# Altium project SignalAnalyse.PrjPCB
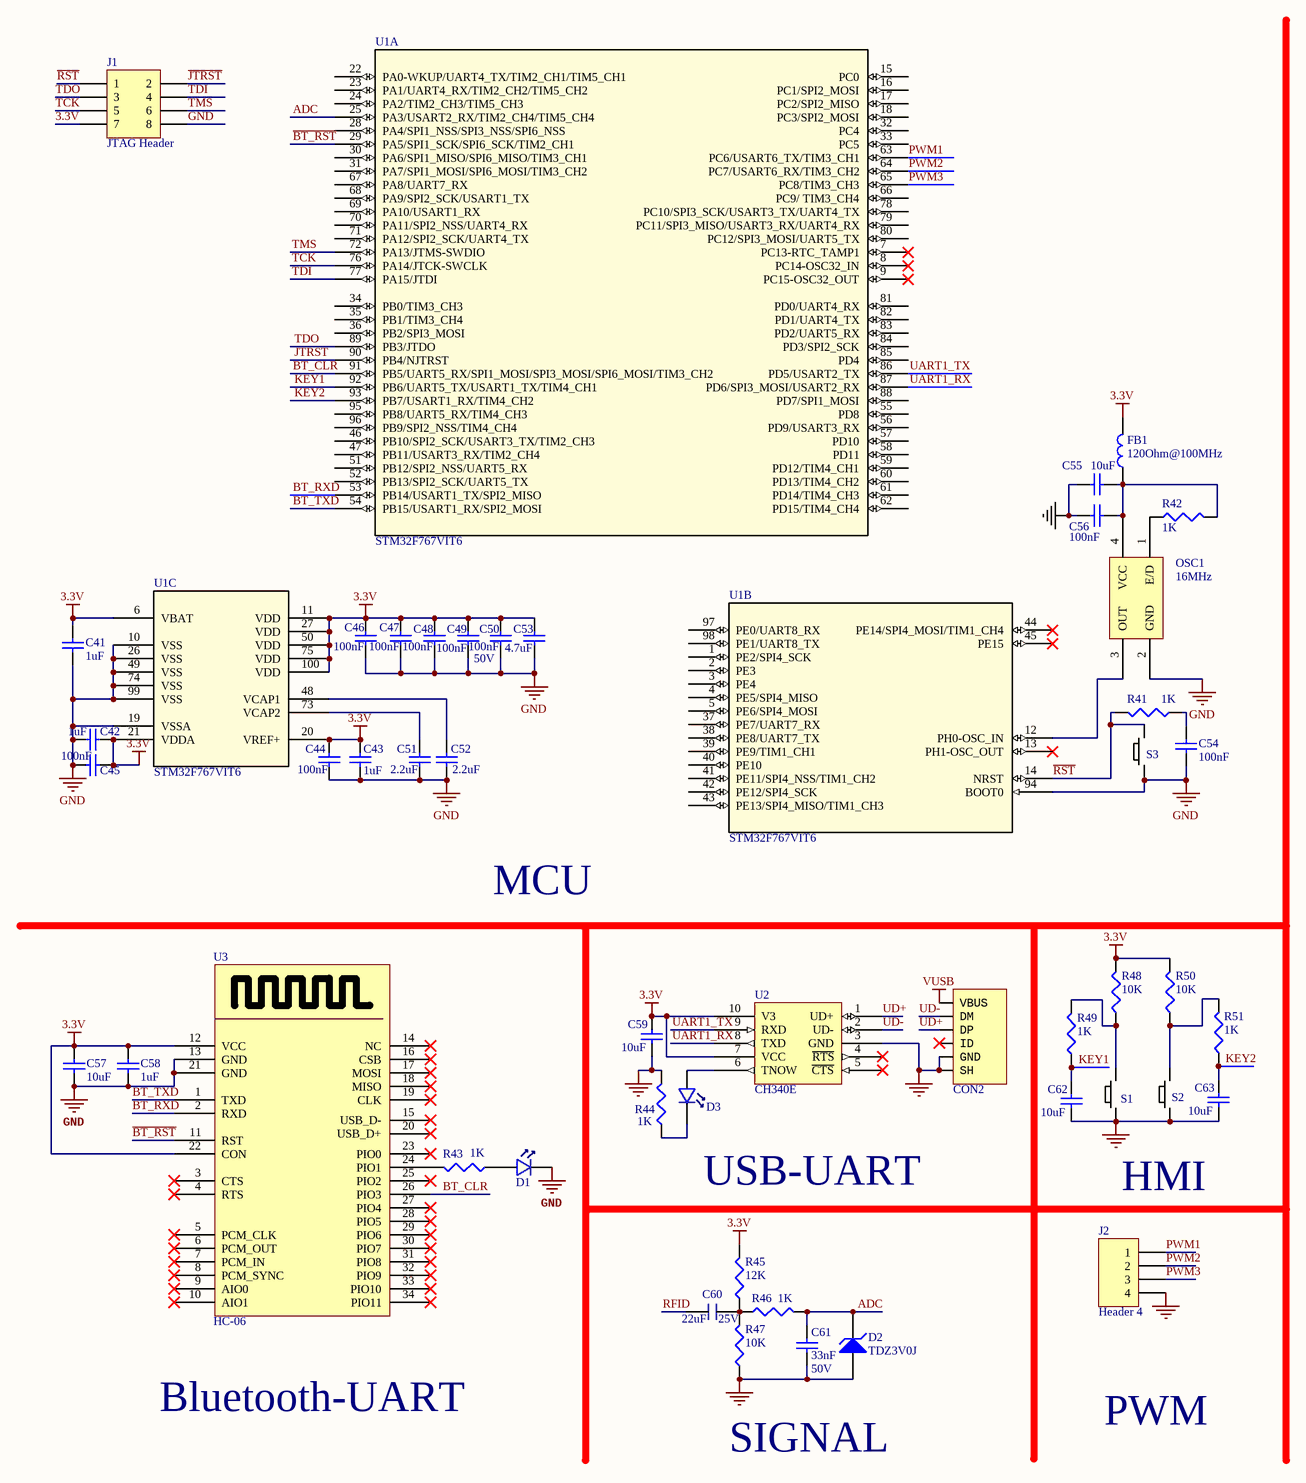
[diagram p0: SignalAnalyse.SchDoc]
2 sheets, 89 parts. Net scope: global (net labels, ports and power ports of the same name join across sheets).
Board file: SignalAnalyse.PcbDoc
Sheets:
  SignalAnalyse.SchDoc
  RFID_transmitter_V2.SchDoc

## Sheet SignalAnalyse.SchDoc
size A3

### Parts
C41  value 1uF  [1608[0603]]  (hidden comment: GRM188R61A226ME15D)
C42  value 1uF  [1608[0603]]  (hidden comment: GRM188R61A226ME15D)
C43  value 1uF  [1608[0603]]  (hidden comment: GRM188R61A226ME15D)
C44  value 100nF  [1608[0603]]  (hidden comment: GRM188R61A226ME15D)
C45  value 100nF  [1608[0603]]  (hidden comment: GRM188R61A226ME15D)
C46  value 100nF  [1608[0603]]  (hidden comment: GRM188R61A226ME15D)
C47  value 100nF  [1608[0603]]  (hidden comment: GRM188R61A226ME15D)
C48  value 100nF  [1608[0603]]  (hidden comment: GRM188R61A226ME15D)
C49  value 100nF  [1608[0603]]  (hidden comment: GRM188R61A226ME15D)
C50  value 100nF  Voltage: 50V  [1608[0603]]  (hidden comment: GRM188R61A226ME15D)
C51  value 2.2uF  [1608[0603]]  (hidden comment: GRM188R61A226ME15D)
C52  value 2.2uF  [1608[0603]]  (hidden comment: GRM188R61A226ME15D)
C53  value 4.7uF  [1608[0603]]  (hidden comment: GRM188R61A226ME15D)
C54  value 100nF  [1608[0603]]  (hidden comment: GRM188R61A226ME15D)
C55  value 10uF  [1608[0603]]  (hidden comment: GRM188R61A226ME15D)
C56  value 100nF  [1608[0603]]  (hidden comment: GRM188R61A226ME15D)
C57  value 10uF  [1608[0603]]  (hidden comment: GRM188R61A226ME15D)
C58  value 1uF  [1608[0603]]  (hidden comment: GRM188R61A226ME15D)
C59  value 10uF  [1608[0603]]  (hidden comment: GRM188R61A226ME15D)
C60  value 22uF  Voltage: 25V  [C0805]  (hidden comment: Cap Ceramic)
C61  value 33nF  Voltage: 50V  [1608[0603]]  (hidden comment: Cap Semi)
C62  value 10uF  [1608[0603]]  (hidden comment: GRM188R61A226ME15D)
C63  value 10uF  [1608[0603]]  (hidden comment: GRM188R61A226ME15D)
CON2  MicroUSB  [USB_Micro-AB]  (value not drawn)
D1  LED  [D0805]  (value not drawn)
D2  TDZ3V0J  [SOD-323]
D3  LED-Green  [D0805]  (value not drawn)
FB1  120Ohm@100MHz  [L0805]
J1  JTAG Header  [HDR2X4]
J2  Header 4  [HDR1X4]
OSC1  16MHz  [OSC_3.2X2.5]
R41  value 1K  [J1-0603]  (hidden comment: Res)
R42  value 1K  [J1-0603]  (hidden comment: Res)
R43  value 1K  [J1-0603]  (hidden comment: Res)
R44  value 1K  [J1-0603]  (hidden comment: Res)
R45  value 12K  [J1-0603]  (hidden comment: Res)
R46  value 1K  [J1-0603]  (hidden comment: Res)
R47  value 10K  [J1-0603]  (hidden comment: Res)
R48  value 10K  [J1-0603]  (hidden comment: Res)
R49  value 1K  [J1-0603]  (hidden comment: Res)
R50  value 10K  [J1-0603]  (hidden comment: Res)
R51  value 1K  [J1-0603]  (hidden comment: Res)
S1  Button  [K2-1107ST-A4SW-06]  (value not drawn)
S2  Button  [K2-1107ST-A4SW-06]  (value not drawn)
S3  Button  [K2-1107ST-A4SW-06]  (value not drawn)
U1  STM32F767VIT6  [STM32F767VIT6]  (parts A,B,C of 3)
U2  CH340E  [CH340E]
U3  HC-06  [HC-06]

### Nets
3.3V: C41.1 C42.1 C43.2 C44.2 C45.1 C46.2 C47.2 C48.2 C49.2 C50.2 C53.2 C57.1 C58.1 C59.1 FB1.1 J1.7 R45.2 R48.2 R50.2 U1.6(VBAT) U1.11(VDD) U1.20(VREF+) U1.21(VDDA) U1.27(VDD) U1.50(VDD) U1.75(VDD) U1.100(VDD) U2.7(VCC) U2.10(V3) U3.12(VCC) U3.22(CON)
GND: C41.2 C42.2 C43.1 C44.1 C45.2 C46.1 C47.1 C48.1 C49.1 C50.1 C51.1 C52.1 C53.1 C54.2 C55.2 C56.2 C57.2 C58.2 C59.2 C61.1 C62.2 C63.2 CON2.0(SH) CON2.5(GND) D1.2 D2.1(A) J1.8 J2.4 OSC1.2(GND) R44.2 R47.1 S1.2 S2.2 S3.2 U1.10(VSS) U1.19(VSSA) U1.26(VSS) U1.49(VSS) U1.74(VSS) U1.94(BOOT0) U1.99(VSS) U2.3(GND) U3.13(GND) U3.21(GND)
VUSB: CON2.1(VBUS)
ADC: C61.2 D2.2(K) R46.2 U1.25(PA3/USART2_RX/TIM2_CH4/TIM5_CH4)
~{BT_RST}: U1.29(PA5/SPI1_SCK/SPI6_SCK/TIM2_CH1) U3.11(RST)
BT_CLR: U1.91(PB5/UART5_RX/SPI1_MOSI/SPI3_MOSI/SPI6_MOSI/TIM3_CH2) U3.26(PIO3)
BT_RXD: U1.53(PB14/USART1_TX/SPI2_MISO) U3.2(RXD)
BT_TXD: U1.54(PB15/USART1_RX/SPI2_MOSI) U3.1(TXD)
~{JTRST}: J1.2 U1.90(PB4/NJTRST)
KEY1: C62.1 R49.1 U1.92(PB6/UART5_TX/USART1_TX/TIM4_CH1)
KEY2: C63.1 R51.1 U1.93(PB7/USART1_RX/TIM4_CH2)
PWM1: J2.1 U1.63(PC6/USART6_TX/TIM3_CH1)
PWM2: J2.2 U1.64(PC7/USART6_RX/TIM3_CH2)
PWM3: J2.3 U1.65(PC8/TIM3_CH3)
~{RST}: J1.1 R41.2 S3.1 U1.14(NRST)
RFID: C60.1
TCK: J1.5 U1.76(PA14/JTCK-SWCLK)
TDI: J1.4 U1.77(PA15/JTDI)
TDO: J1.3 U1.89(PB3/JTDO)
TMS: J1.6 U1.72(PA13/JTMS-SWDIO)
UART1_RX: U1.87(PD6/SPI3_MOSI/USART2_RX) U2.8(TXD)
UART1_TX: U1.86(PD5/USART2_TX) U2.9(RXD)
UD+: CON2.3(DP) U2.1(UD+)
UD-: CON2.2(DM) U2.2(UD-)
NetC51_2: C51.2 U1.73(VCAP2)
NetC52_2: C52.2 U1.48(VCAP1)
NetC54_1: C54.1 R41.1
NetC55_1: C55.1 C56.1 FB1.2 OSC1.4(VCC) R42.2
NetC60_2: C60.2 R45.1 R46.1 R47.2
NetD1_1: D1.1 R43.1
NetD3_1: D3.1 U2.6(TNOW)
NetD3_2: D3.2 R44.1
NetOSC1_1: OSC1.1(E/D) R42.1
NetOSC1_3: OSC1.3(OUT) U1.12(PH0-OSC_IN)
NetR43_2: R43.2 U3.24(PIO1)
NetR48_1: R48.1 R49.2 S1.1
NetR50_1: R50.1 R51.2 S2.1

Not connected (* = marked no-connect by the designer): CON2 4(ID)*; U1 1(PE2/SPI4_SCK) 2(PE3) 3(PE4) 4(PE5/SPI4_MISO) 5(PE6/SPI4_MOSI) 7(PC13-RTC_TAMP1)* 8(PC14-OSC32_IN)* 9(PC15-OSC32_OUT)* 13(PH1-OSC_OUT)* 15(PC0) 16(PC1/SPI2_MOSI) 17(PC2/SPI2_MISO) 18(PC3/SPI2_MOSI) 22(PA0-WKUP/UART4_TX/TIM2_CH1/TIM5_CH1) 23(PA1/UART4_RX/TIM2_CH2/TIM5_CH2) 24(PA2/TIM2_CH3/TIM5_CH3) 28(PA4/SPI1_NSS/SPI3_NSS/SPI6_NSS) 30(PA6/SPI1_MISO/SPI6_MISO/TIM3_CH1) 31(PA7/SPI1_MOSI/SPI6_MOSI/TIM3_CH2) 32(PC4) 33(PC5) 34(PB0/TIM3_CH3) 35(PB1/TIM3_CH4) 36(PB2/SPI3_MOSI) 37(PE7/UART7_RX) 38(PE8/UART7_TX) 39(PE9/TIM1_CH1) 40(PE10) 41(PE11/SPI4_NSS/TIM1_CH2) 42(PE12/SPI4_SCK) 43(PE13/SPI4_MISO/TIM1_CH3) 44(PE14/SPI4_MOSI/TIM1_CH4)* 45(PE15)* 46(PB10/SPI2_SCK/USART3_TX/TIM2_CH3) 47(PB11/USART3_RX/TIM2_CH4) 51(PB12/SPI2_NSS/UART5_RX) 52(PB13/SPI2_SCK/UART5_TX) 55(PD8) 56(PD9/USART3_RX) 57(PD10) 58(PD11) 59(PD12/TIM4_CH1) 60(PD13/TIM4_CH2) 61(PD14/TIM4_CH3) 62(PD15/TIM4_CH4) 66(PC9/_TIM3_CH4) 67(PA8/UART7_RX) 68(PA9/SPI2_SCK/USART1_TX) 69(PA10/USART1_RX) 70(PA11/SPI2_NSS/UART4_RX) 71(PA12/SPI2_SCK/UART4_TX) 78(PC10/SPI3_SCK/USART3_TX/UART4_TX) 79(PC11/SPI3_MISO/USART3_RX/UART4_RX) 80(PC12/SPI3_MOSI/UART5_TX) 81(PD0/UART4_RX) 82(PD1/UART4_TX) 83(PD2/UART5_RX) 84(PD3/SPI2_SCK) 85(PD4) 88(PD7/SPI1_MOSI) 95(PB8/UART5_RX/TIM4_CH3) 96(PB9/SPI2_NSS/TIM4_CH4) 97(PE0/UART8_RX) 98(PE1/UART8_TX); U2 4(~{RTS})* 5(~{CTS})*; U3 3(CTS)* 4(RTS)* 5(PCM_CLK)* 6(PCM_OUT)* 7(PCM_IN)* 8(PCM_SYNC)* 9(AIO0)* 10(AIO1)* 14(NC)* 15(USB_D-)* 16(CSB)* 17(MOSI)* 18(MISO)* 19(CLK)* 20(USB_D+)* 23(PIO0)* 25(PIO2)* 27(PIO4)* 28(PIO5)* 29(PIO6)* 30(PIO7)* 31(PIO8)* 32(PIO9)* 33(PIO10)* 34(PIO11)*

### Notes on the sheet
- MCU
- USB-UART
- HMI
- Bluetooth-UART
- PWM
- SIGNAL

### Library data of the parts
C41-C49 C54 C56 C58 = Cap Semi: Capacitor (Semiconductor SIM Model); Voltage: 50V; Published: 8-Jun-2000; LatestRevisionDate: 29-May-2009; LatestRevisionNote: IPC-7351 Footprint Added.; PackageReference: C1206; Publisher: Altium Limited; PackageDescription: Chip Capacitor
C50 C61 = Cap Semi: Capacitor (Semiconductor SIM Model); Published: 8-Jun-2000; LatestRevisionDate: 29-May-2009; LatestRevisionNote: IPC-7351 Footprint Added.; Publisher: Altium Limited; PackageDescription: Chip Capacitor
  C50: PackageReference: C1206
  C61: PackageReference: C0603
C51 C52 = Cap Semi: Capacitor (Semiconductor SIM Model); Voltage: 16V; Published: 8-Jun-2000; LatestRevisionDate: 29-May-2009; LatestRevisionNote: IPC-7351 Footprint Added.; PackageReference: C1206; Publisher: Altium Limited; PackageDescription: Chip Capacitor
C53 C55 C57 C59 C62 C63 = Cap Semi: Capacitor (Semiconductor SIM Model); Voltage: 10V; Published: 8-Jun-2000; LatestRevisionDate: 29-May-2009; LatestRevisionNote: IPC-7351 Footprint Added.; PackageReference: C1206; Publisher: Altium Limited; PackageDescription: Chip Capacitor
C60 = C-Ceramic
CON2 = USB_Micro: USB; Type: B-type
D1 = LED: UWB_TX_LED
D2 = D Zener: Zener Diode 3V; Published: 8-Jun-2000; LatestRevisionDate: 17-Jul-2002; LatestRevisionNote: Re-released for DXP Platform.; PackageReference: DIODE-0.7; Publisher: Altium Limited; PackageDescription: Diode, Thru-Hole; 2 Leads; 0.7 in Pin Spacing
D3 = LED
FB1 = FB: CBW201209U121T; Value: 120R
J1 = Header 4X2: Header, 4-Pin, Dual row; LatestRevisionDate: 17-Jul-2002; LatestRevisionNote: Re-released for DXP Platform.; Publisher: Altium Limited
J2 = Header 4: Header, 4-Pin; LatestRevisionDate: 17-Jul-2002; LatestRevisionNote: Re-released for DXP Platform.; Publisher: Altium Limited
OSC1 = OSC2: OSC with disable function
R41-R51 = Res3: Resistor; Published: 8-Jun-2000; LatestRevisionDate: 29-May-2009; LatestRevisionNote: IPC-7351 Footprint Added.; PackageReference: J1-0603; Publisher: Altium Limited; PackageDescription: Chip Resistor
U1 = STM32F76XVXT: Imported; Vendor: STMicroelectronics; C: Copyright (C) 2016 Accelerated Designs. All rights reserved; Manufacturer_Part_Number: stm32f76xvxt; Copyright: Copyright (C) 2016 Accelerated Designs. All rights reserved; Value: Value; Type: Type; RefDes: RefDes
U2 = CH340E: USB-UART Converter
U3 = HC-06: Decawave's DW1000 Ultra Wideband (UWB) transceiver IC

## Sheet RFID_transmitter_V2.SchDoc
size A
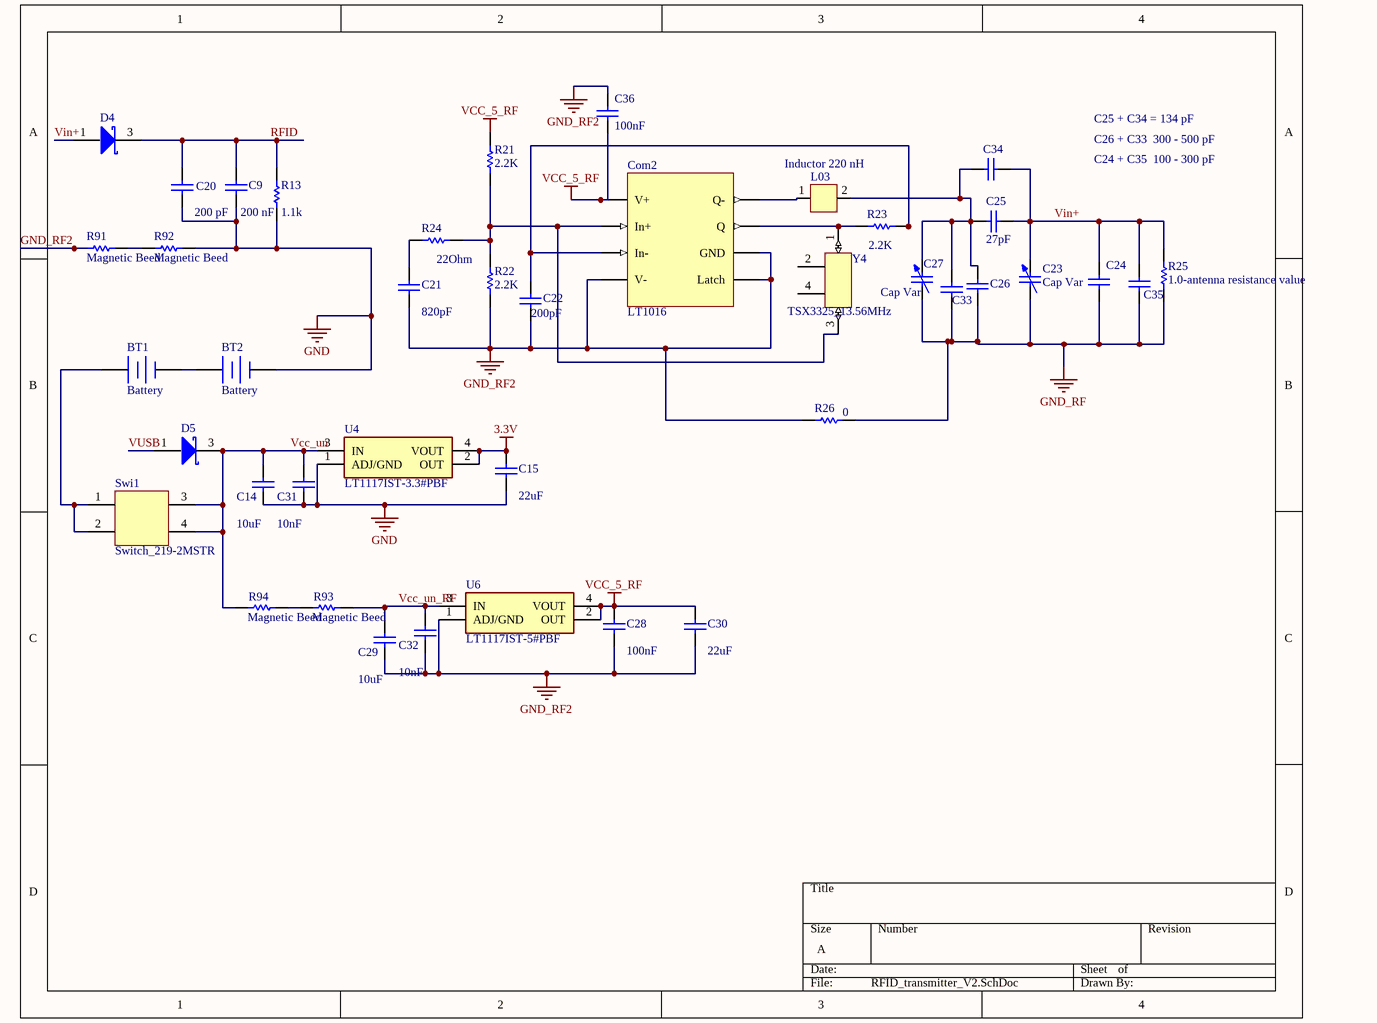
[diagram p1: RFID_transmitter_V2.SchDoc]

### Parts
BT1  Battery  [Battery]
BT2  Battery  [Battery]
C9  value 200 nF  [0603]  (hidden comment: Cap 10n)
C14  value 10uF  [0603]  (hidden comment: Cap 10u)
C15  value 22uF  [0603]  (hidden comment: Cap 22u)
C20  value 200 pF  [0603]  (hidden comment: Cap 4.7n)
C21  value 820pF  [0603]  (hidden comment: Cap 820p)
C22  value 200pF  [0603]  (hidden comment: Cap 200p)
C23  Cap Var  [Variable_Capacitor_JZ400HV1]
C24  Cap  [0603]  (value not drawn)
C25  value 27pF  [0603]  (hidden comment: Cap)
C26  random value needs carefully address  [0603]  (value not drawn)
C27  Cap Var  [Variable_Capacitor_JZ400HV1]
C28  value 100nF  [0603]  (hidden comment: Cap 100n)
C29  value 10uF  [0603]  (hidden comment: Cap 10u)
C30  value 22uF  [0603]  (hidden comment: Cap 22u)
C31  value 10nF  [0603]  (hidden comment: Cap 10n)
C32  value 10nF  [0603]  (hidden comment: Cap 10n)
C33  random value needs carefully address  [0603]  (value not drawn)
C34  Cap  [0603]  (value not drawn)
C35  Cap  [0603]  (value not drawn)
C36  value 100nF  [1608[0603]]  (hidden comment: GRM188R61A226ME15D)
Com2  LT1016  [LT1016_SOIC]
D4  SMMBD301LT3G  [SOT96P237X111-3N]  (value not drawn)
D5  SMMBD301LT3G  [SOT96P237X111-3N]  (value not drawn)
L03  Inductor 220 nH  [Ferrite_bead_0805inch_2012mm]
R13  value 1.1k  [0603]  (hidden comment: Res1)
R21  value 2.2K  [0603]  (hidden comment: Res1 2.2k)
R22  value 2.2K  [0603]  (hidden comment: Res1 2.2k)
R23  value 2.2K  [0603]  (hidden comment: Res1 2.2k)
R24  value 22Ohm  [0603]  (hidden comment: Res1 22)
R25  value 1.0-antenna resistance value  [0603]
R26  value 0  [0603]  (hidden comment: Magnetic Beed)
R91  Magnetic Beed  [0603]
R92  Magnetic Beed  [0603]
R93  Magnetic Beed  [0603]
R94  Magnetic Beed  [0603]
Swi1  Switch_219-2MSTR  [Switch_219-2MSTR]
U4  LT1117IST-3.3#PBF  [SOT230P700X180-4N]
U6  LT1117IST-5#PBF  [SOT230P700X180-4N]
Y4  TSX3325_13.56MHz  [HC_49Crystal]

### Nets
3.3V: C15.2 U4.2(OUT) U4.4(VOUT)
GND: BT2.2(-) C9.1 C14.1 C15.1 C20.1 C31.1 R13.1 R92.2 U4.1(ADJ/GND)
GND_RF: C23.1 C24.1 C26.2 C27.1 C33.2 C35.1 R25.1 R26.2
GND_RF2: C21.1 C22.1 C28.1 C29.1 C30.1 C32.1 C36.2 Com2.4(V-) Com2.5(Latch) Com2.6(GND) R22.1 R26.1 R91.1 U6.1(ADJ/GND)
VCC_5_RF: C28.2 C30.2 C36.1 Com2.1(V+) R21.2 U6.2(OUT) U6.4(VOUT)
VUSB: D5.1(ANODE)
RFID: C9.2 C20.2 D4.3(CATHODE) R13.2
Vcc_un: C14.2 C31.2 D5.3(CATHODE) R94.1 Swi1.3(Out1) Swi1.4(Out2) U4.3(IN)
Vcc_un_RF: C29.2 C32.2 R93.2 U6.3(IN)
Vin+: C23.2 C24.2 C25.1 C34.1 C35.2 D4.1(ANODE) R25.2
NetBT1_1: BT1.1(+) Swi1.1(In1) Swi1.2(In2)
NetBT1_2: BT1.2(-) BT2.1(+)
NetC21_2: C21.2 R24.1
NetC22_2: C22.2 Com2.3(In-) R23.2
NetC25_2: C25.2 C26.1 C27.2 C33.1 C34.2 L03.2
NetCom2_2: Com2.2(In+) R21.1 R22.2 R24.2 Y4.3(Out)
NetCom2_7: Com2.7(Q) R23.1 Y4.1(In)
NetCom2_8: Com2.8(Q-) L03.1
NetR91_2: R91.2 R92.1
NetR93_1: R93.1 R94.2

Not connected (* = marked no-connect by the designer): Y4 2(GND) 4(GND)

### Notes on the sheet
- C25 + C34 = 134 pF
- C26 + C33  300 - 500 pF
- C24 + C35  100 - 300 pF

### Library data of the parts
BT1 BT2 = Battery: Multicell Battery; Published: 24-Mar-1999; LatestRevisionDate: 17-Jul-2002; LatestRevisionNote: Re-released for DXP Platform.; PackageReference: BAT-2; Publisher: Altium Limited; PackageDescription: Battery; 2 Leads
C9 C14 C15 C20-C22 C28-C32 = Cap: Capacitor; Published: 8-Jun-2000; LatestRevisionDate: 17-Jul-2002; LatestRevisionNote: Re-released for DXP Platform.; PackageReference: RAD-0.3; Publisher: Altium Limited; PackageDescription: Radial Cap, Thru-Hole; 2 Leads; 0.3 in Pin Spacing
C23 C27 = Cap Var: Variable or Adjustable Capacitor; Value: 100pF; Published: 24-Mar-1999; LatestRevisionDate: 29-May-2009; LatestRevisionNote: IPC-7351 Footprint Added.; PackageReference: C1210; Publisher: Altium Limited; PackageDescription: Chip Capacitor 1210 Case Size; Code_JEITA: 1210; Code_IPC: CAPC3225
C24 = Cap: Capacitor_for resonance; Value: 22pF; Published: 8-Jun-2000; LatestRevisionDate: 17-Jul-2002; LatestRevisionNote: Re-released for DXP Platform.; PackageReference: RAD-0.3; Publisher: Altium Limited; PackageDescription: Radial Cap, Thru-Hole; 2 Leads; 0.3 in Pin Spacing
C25 = Cap: Capacitor_for resonance; Published: 8-Jun-2000; LatestRevisionDate: 17-Jul-2002; LatestRevisionNote: Re-released for DXP Platform.; PackageReference: RAD-0.3; Publisher: Altium Limited; PackageDescription: Radial Cap, Thru-Hole; 2 Leads; 0.3 in Pin Spacing
C26 = Cap: Capacitor_for resonance; Value: 470pF; Published: 8-Jun-2000; LatestRevisionDate: 17-Jul-2002; LatestRevisionNote: Re-released for DXP Platform.; PackageReference: RAD-0.3; Publisher: Altium Limited; PackageDescription: Radial Cap, Thru-Hole; 2 Leads; 0.3 in Pin Spacing
C33-C35 = Cap: Capacitor_for resonance; Value: 1pF; Published: 8-Jun-2000; LatestRevisionDate: 17-Jul-2002; LatestRevisionNote: Re-released for DXP Platform.; PackageReference: RAD-0.3; Publisher: Altium Limited; PackageDescription: Radial Cap, Thru-Hole; 2 Leads; 0.3 in Pin Spacing
C36 = Cap Semi: as C53 on sheet SignalAnalyse; Published: 8-Jun-2000; LatestRevisionDate: 29-May-2009; LatestRevisionNote: IPC-7351 Footprint Added.; PackageReference: C1206; Publisher: Altium Limited; PackageDescription: Chip Capacitor
D4 D5 = SMMBD301LT3G: Schottky Barrier Diodes; Manufacturer_Name: ON Semiconductor; Datasheet Link: https://altium.componentsearchengine.com/Datasheets/1/SMMBD301LT3G.pdf; Height: 1.11mm; Manufacturer_Part_Number: SMMBD301LT3G
L03 = Component_1: 220nH
R13 R21-R25 = Res1: Resistor; Published: 8-Jun-2000; LatestRevisionDate: 17-Jul-2002; LatestRevisionNote: Re-released for DXP Platform.; PackageReference: AXIAL-0.3; Publisher: Altium Limited; PackageDescription: Axial Device, Thru-Hole; 2 Leads; 0.3 in Pin Spacing
R26 = Res1: Wurth Magnetic Bead; Published: 8-Jun-2000; LatestRevisionDate: 17-Jul-2002; LatestRevisionNote: Re-released for DXP Platform.; PackageReference: AXIAL-0.3; Publisher: Altium Limited; PackageDescription: Axial Device, Thru-Hole; 2 Leads; 0.3 in Pin Spacing
R91 R92 = Res1: Wurth Magnetic Bead; Value: 0; Published: 8-Jun-2000; LatestRevisionDate: 17-Jul-2002; LatestRevisionNote: Re-released for DXP Platform.; PackageReference: AXIAL-0.3; Publisher: Altium Limited; PackageDescription: Axial Device, Thru-Hole; 2 Leads; 0.3 in Pin Spacing
R93 R94 = Res1: Resistor; Value: 0 Ohm; Published: 8-Jun-2000; LatestRevisionDate: 17-Jul-2002; LatestRevisionNote: Re-released for DXP Platform.; PackageReference: AXIAL-0.3; Publisher: Altium Limited; PackageDescription: Axial Device, Thru-Hole; 2 Leads; 0.3 in Pin Spacing
U4 = LT1117IST-3.3#PBF: Integrated Circuit; Manufacturer_Name: Analog Devices; Datasheet Link: https://www.analog.com/media/en/technical-documentation/data-sheets/1117fd.pdf; Height: 1.8mm; Manufacturer_Part_Number: LT1117IST-3.3#PBF; Mouser Part Number: 584-LT1117IST-3.3PBF
Y4 = TSX3325

## Nets that join several sheets
3.3V: SignalAnalyse (31 pins), RFID_transmitter_V2 (C15.2 U4.2 U4.4)
GND: SignalAnalyse (44 pins), RFID_transmitter_V2 (9 pins)
VUSB: SignalAnalyse (CON2.1), RFID_transmitter_V2 (D5.1)
RFID: SignalAnalyse (C60.1), RFID_transmitter_V2 (C9.2 C20.2 D4.3 R13.2)